# EAGLE design evenFieldDriverBoard (EAGLE 9.0.1)
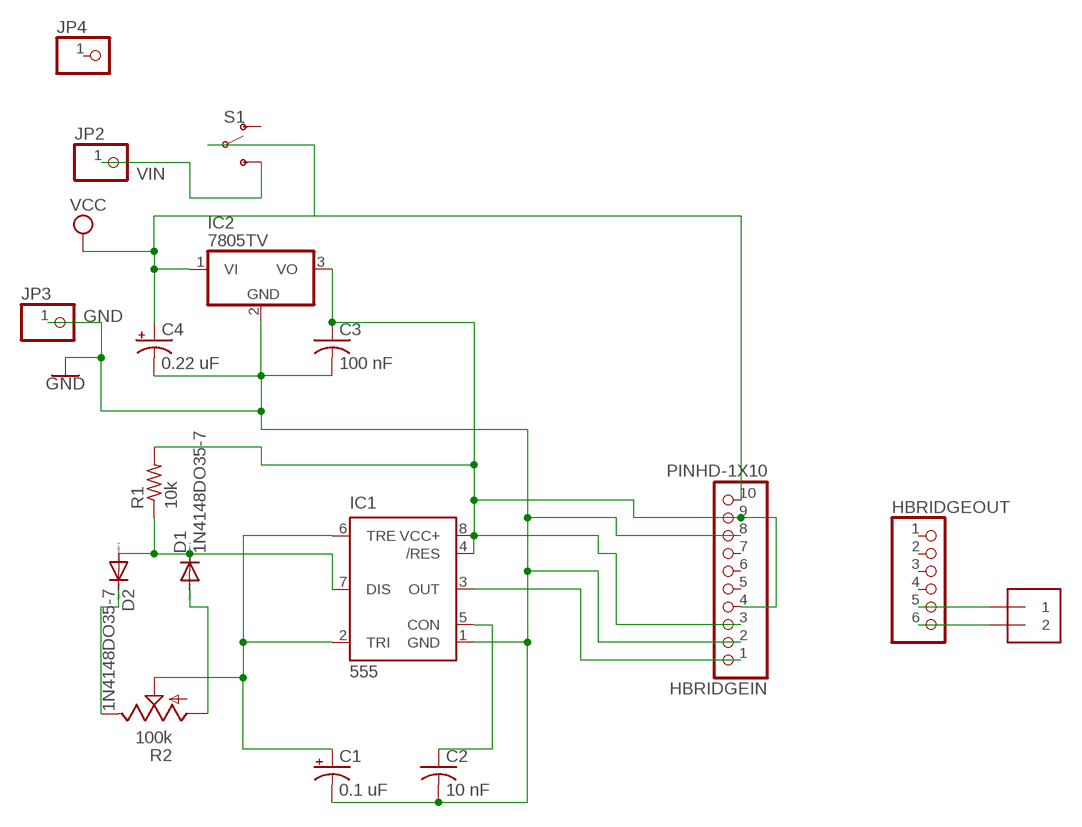
[diagram p0: schematic, sheet 1]

## Parts
C1  0.1 uF  CPOL-USB45181A  [B45181A]
C2  10 nF  C-US025-025X050  [C025-025X050]
C3  100 nF  C-US025-025X050  [C025-025X050]
C4  0.22 uF  CPOL-USB45181A  [B45181A]
D1  1N4148DO35-7  [DO35-7]
D2  1N4148DO35-7  [DO35-7]
HBRIDGEIN  PINHD-1X10  [1X10-BIG]
HBRIDGEOUT  PINHD-1X6  [1X06]
IC1  555  555P  [DIP08]
IC2  7805TV  [TO220V]
J1  1X2-3.5MM  [1X2-3.5MM]
JP2  PINHD-1X1  [1X01]
JP3  PINHD-1X1  [1X01]
JP4  PINHD-1X1  [1X01]
R1  10k  R-US_0309/V  [0309V]
R2  100k  TRIM_US-RJ9W  [RJ9W]
S1  SWITCH-SPDT-PTH-11.6X4.0MM  [SWITCH_SPDT_PTH_11.6X4.0MM]

## Nets
GND: C1.- C2.2 C3.2 C4.- HBRIDGEIN.2 HBRIDGEIN.8 IC1.1(GND) IC2.2(GND) JP3.1
N$3: C3.1 HBRIDGEIN.3 HBRIDGEIN.4 HBRIDGEIN.9 IC1.4(/RES) IC1.8(VCC+) IC2.3(VO) R1.2
N$5: D2.C R2.E
N$6: D1.A R2.A
N$7: C1.+ IC1.2(TRI) IC1.6(TRE) R2.S
N$9: C2.1 IC1.5(CON)
N$10: D1.C D2.A IC1.7(DIS) R1.1
N$11: HBRIDGEIN.1 IC1.3(OUT)
N$16: HBRIDGEOUT.5 J1.1
N$17: HBRIDGEOUT.6 J1.2
VCC: C4.+ HBRIDGEIN.10 IC2.1(VI) S1.2(P)
VIN: JP2.1 S1.3(S)
Unconnected: HBRIDGEIN.5 HBRIDGEIN.6 HBRIDGEIN.7 HBRIDGEOUT.1 HBRIDGEOUT.2 HBRIDGEOUT.3 HBRIDGEOUT.4 JP4.1 S1.1(O)

## Library data of the parts
C1 C4 = adafruit:CPOL-US: POLARIZED CAPACITOR, American symbol
C2 C3 = adafruit:C-US: CAPACITOR, American symbol
D1 D2 = diode:1N4148: DIODE high speed (Philips)
HBRIDGEIN = adafruit:PINHD-1X10: Pin header 1x10 0.1" spacing With round pins
HBRIDGEOUT = adafruit:PINHD-1X6: PIN HEADER
IC1 = SparkFun-IC-Special-Function:555: General purpose bipolar Timer Datasheet <http://www.sparkfun.com/datasheets/Components/General/ne555.pdf> SparkFun Products SparkFun SparkPunk Sequencer Kit <https://www.sparkfun.com/products/12707> (KIT-12707) Storefront Component: 555 Timer <https://www.sparkfun.com/products/9273> (COM-09273) Two parts valid for production: VFP: IC-11930 (M7555 PTH) VFP: IC-09173 (555 PTH) - Preferred; PROD_ID: IC-09173; PROD_ID_ALT: IC-09173
IC2 = linear:78*: Positive VOLTAGE REGULATOR Source: http://cache.national.com/ds/LM/LM78L05.pdf http://www.fairchildsemi.com/ds/LM/LM7805.pdf
J1 = adafruit:1X2: 3.5mm Terminal block http://www.ladyada.net/library/pcb/eaglelibrary.html
JP2-JP4 = adafruit:PINHD-1X1: Pin header 1x1 for 0.1" spacing With round pins
R1 = resistor:R-US_: RESISTOR, American symbol
R2 = pot:TRIM_US-: POTENTIOMETER
S1 = SparkFun-Switches:SWITCH-SPDT: Single Pole, Double Throw (SPDT) Switch Single-pole, double-throw (SPDT) switch. Variant Overview SMD-AYZ0202 Surface Mount DPDT Switch <https://www.sparkfun.com/products/597> (COM-00597) Used on e.g. LilyPad Arduino USB - ATmega32U4 Board <https://www.sparkfun.com/products/12049> PTH-11.6X4.0MM SPDT Mini Power Switch <https://www.sparkfun.com/products/102> (COM-00102) Used on e.g. SparkFun Simon Says - Through-Hole Soldering Kit <https://www.sparkfun.com/products/10547> (KIT-10547) PTH-11.6X4.0MM-KIT KIT version of SPDT Mini Power Switch - Simplifies soldering by removing tStop of switch pins - only one side can be soldered. PTH-11.6X4.0MM-LOCK LOCK version of SPDT Mini Power Switch - Offset pins hold switch in place for easier soldering. SMD-RIGHT-ANGLE Surface Mount Right Angle Switch <https://www.sparkfun.com/products/10860> (COM-10860) Used on e.g. SparkFun ESP8266 Thing <https://www.sparkfun.com/products/13231>; PROD_ID: SWCH-08261; SF_SKU: COM-00102

## Board
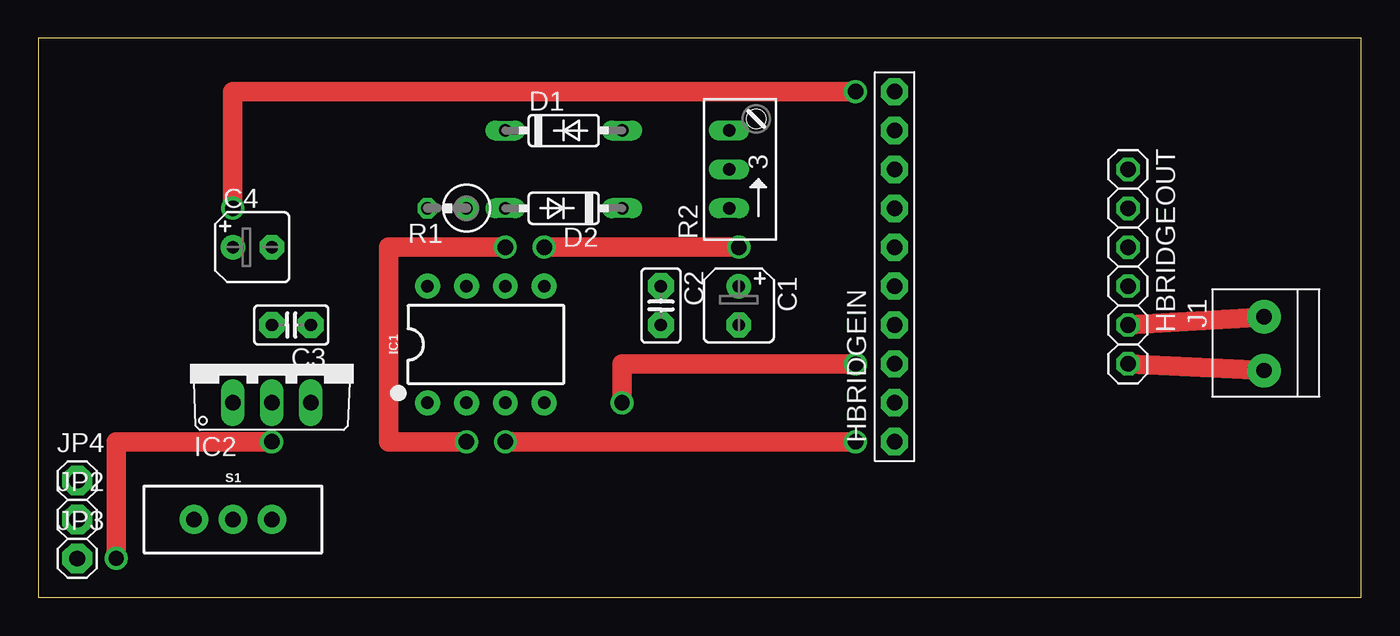
[diagram p1: board, top side]
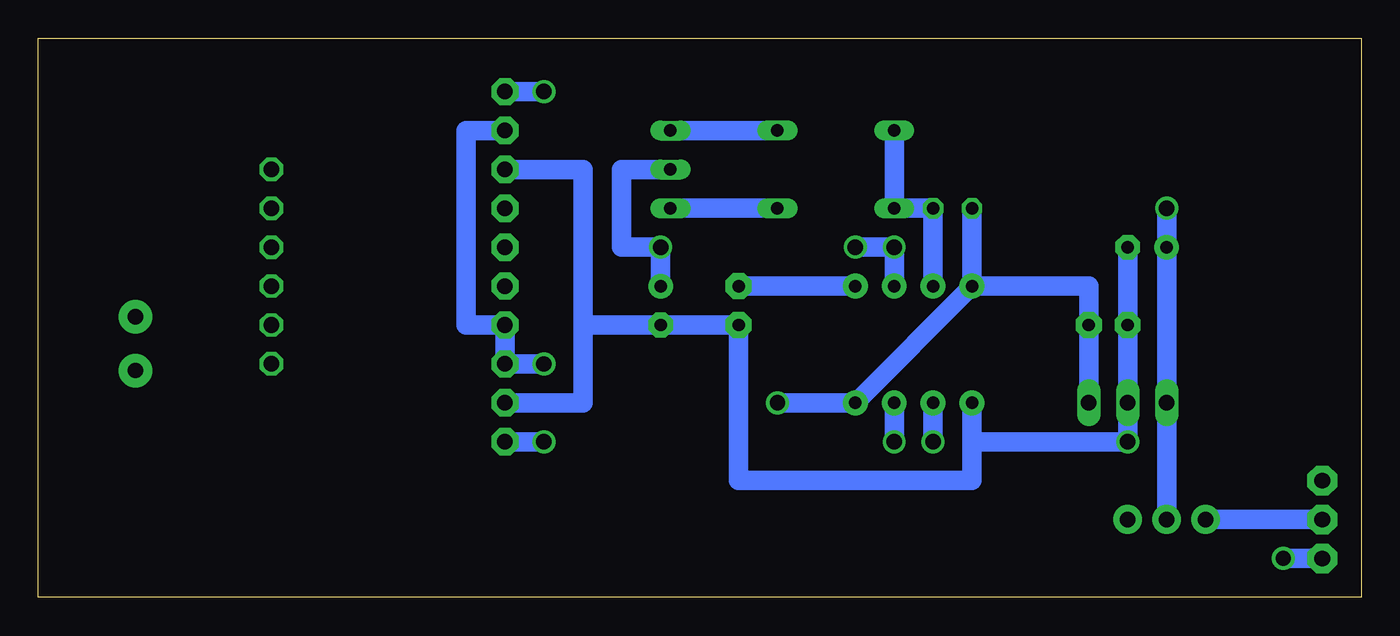
[diagram p2: board, bottom side, seen from below]

Size 86.34 x 36.5 mm. Coordinates in mm from the lower left corner, seen from the top.
Outline: 0,0 86.34,0 86.34,36.5 0,36.5 0,0
Copper layers (1*16): Top 0.035mm / dielectric 1.5mm / Bottom 0.035mm
Design rules "default": minimum track width 6mil, minimum drill 0.35mm, track to track 6mil, track to pad 6mil, pad to pad 6mil, via to via 6mil, smd to smd 6mil, copper to edge 40mil, drill to drill 6mil, minimum pad ring 10mil, minimum via ring 8mil, stop-mask expansion 4mil, vias tented up to drill 0mil, thermal gap 10mil

### Footprints (pad centres in the part's own frame; a part is rotated, then mirrored left to right if it is on the bottom)
B45181A = drill 0.813 pad 1.6: + -1.27,0 | drill 0.813 pad 1.6 octagon: - 1.27,0
C025-025X050 = drill 0.813 pad 1.676 octagon: 1 -1.27,0; 2 1.27,0
DO35-7 = drill 0.813 long: A 3.81,0; C -3.81,0
1X10-BIG = drill 1.016 pad 1.778 octagon: 1 -11.43,0; 2 -8.89,0; 3 -6.35,0; 4 -3.81,0; 5 -1.27,0; 6 1.27,0; 7 3.81,0; 8 6.35,0; 9 8.89,0; 10 11.43,0
1X06 = drill 1.016 octagon: 1 -6.35,0; 2 -3.81,0; 3 -1.27,0; 4 1.27,0; 5 3.81,0; 6 6.35,0
DIP08 = drill 0.813 pad 1.626: 1 -3.81,-3.81; 2 -1.27,-3.81; 3 1.27,-3.81; 4 3.81,-3.81; 5 3.81,3.81; 6 1.27,3.81; 7 -1.27,3.81; 8 -3.81,3.81
TO220V = drill 1.016 long: 1 -2.54,-2.54; 2 0,-2.54; 3 2.54,-2.54
1X2-3.5MM = drill 1 pad 2.184: 1 1.8,0; 2 -1.7,0
1X01 = drill 1.016 pad 1.93 octagon: 1 0,0
0309V = drill 0.813 octagon: 1 -1.27,0; 2 1.27,0
RJ9W = drill 0.813 long: A 2.54,0.635; E -2.54,0.635; S 0,0.635
SWITCH_SPDT_PTH_11.6X4.0MM = drill 1.016 pad 1.88: 1 0,2.54; 2 0,0; 3 0,-2.54

### Placement (x,y rotation side)
C1  45.72,19.05 270 top
C2  40.64,19.05 270 top
C3  16.51,17.78 180 top
C4  13.97,22.86 0 top
D1  34.29,30.48 0 top
D2  34.29,25.4 180 top
HBRIDGEIN  55.88,21.59 90 top
HBRIDGEOUT  71.12,21.59 270 top
IC1  29.21,16.51 0 top
IC2  15.24,15.24 0 top
J1  80.01,16.51 90 top
JP2  2.54,5.08 0 top
JP3  2.54,2.54 0 top
JP4  2.54,7.62 0 top
R1  26.67,25.4 180 top
R2  45.72,27.94 90 top
S1  12.7,5.08 270 top

### Tracks (layer width: path | path; a pad name or v marks a point on that pad's centre or on a via)
GND  (via drill 1)
  Top 1.27: v5.08,2.54 5.08,10.16 v15.24,10.16
  Bottom 1.27: C4.- C3.2 IC2.2 v15.24,10.16 25.4,10.16 | 25.4,10.16 IC1.1 | 25.4,10.16 25.4,7.62 40.64,7.62 C2.2 C1.- 50.8,17.78 | 50.8,17.78 50.8,27.94 HBRIDGEIN.8 | 50.8,17.78 50.8,12.7 HBRIDGEIN.2 | JP3.1 v5.08,2.54
N$3  (via drill 1)
  Top 1.27: v38.1,12.7 38.1,15.24 v53.34,15.24
  Bottom 1.27: IC2.3 C3.1 17.78,20.32 IC1.8 | IC1.8 IC1.4 v38.1,12.7 | R1.2 IC1.8 | HBRIDGEIN.9 58.42,30.48 58.42,17.78 HBRIDGEIN.4 HBRIDGEIN.3 v53.34,15.24
N$5
  Bottom 1.27: D2.C R2.E
N$6
  Bottom 1.27: D1.A R2.A
N$7  (via drill 1)
  Top 1.27: v27.94,10.16 22.86,10.16 22.86,22.86 v30.48,22.86 | v33.02,22.86 v45.72,22.86
  Bottom 1.27: IC1.2 v27.94,10.16 | IC1.6 v30.48,22.86 v33.02,22.86 | C1.+ v45.72,22.86 48.26,22.86 48.26,27.94 R2.S
N$9
  Bottom 1.27: IC1.5 C2.1
N$10
  Bottom 1.27: IC1.7 R1.1 D2.A D1.C
N$11  (via drill 1)
  Top 1.27: v30.48,10.16 v53.34,10.16
  Bottom 1.27: IC1.3 v30.48,10.16 | v53.34,10.16 HBRIDGEIN.1
N$16
  Top 1.27: HBRIDGEOUT.5 J1.1
N$17
  Top 1.27: J1.2 HBRIDGEOUT.6
VCC  (via drill 1)
  Top 1.27: v12.7,25.4 12.7,33.02 v53.34,33.02
  Bottom 1.27: S1.2 IC2.1 C4.+ v12.7,25.4 | v53.34,33.02 HBRIDGEIN.10
VIN
  Bottom 1.27: S1.3 JP2.1